# Altium schematic sheet Microprocessor PIC18F46K80.SCHDOC
size A4; PageSetup: Record=PageOptions|CenterHorizontal=True|CenterVertical=True|PrintScale=0.70|XCorrection=1.00|YCorrection=1.00|PrintKind=2|BorderSize=5000000|LeftOffset=0|BottomOffset=0|Orientation=2|PaperLength=1000|PaperWidth=1000|Scale=100|PaperSource=7|PrintQuality=-4|MediaType=1|DitherType=10|PaperKind=A4|PrintScaleMode=1; DocumentName: CCPA V203 (RELEASE)
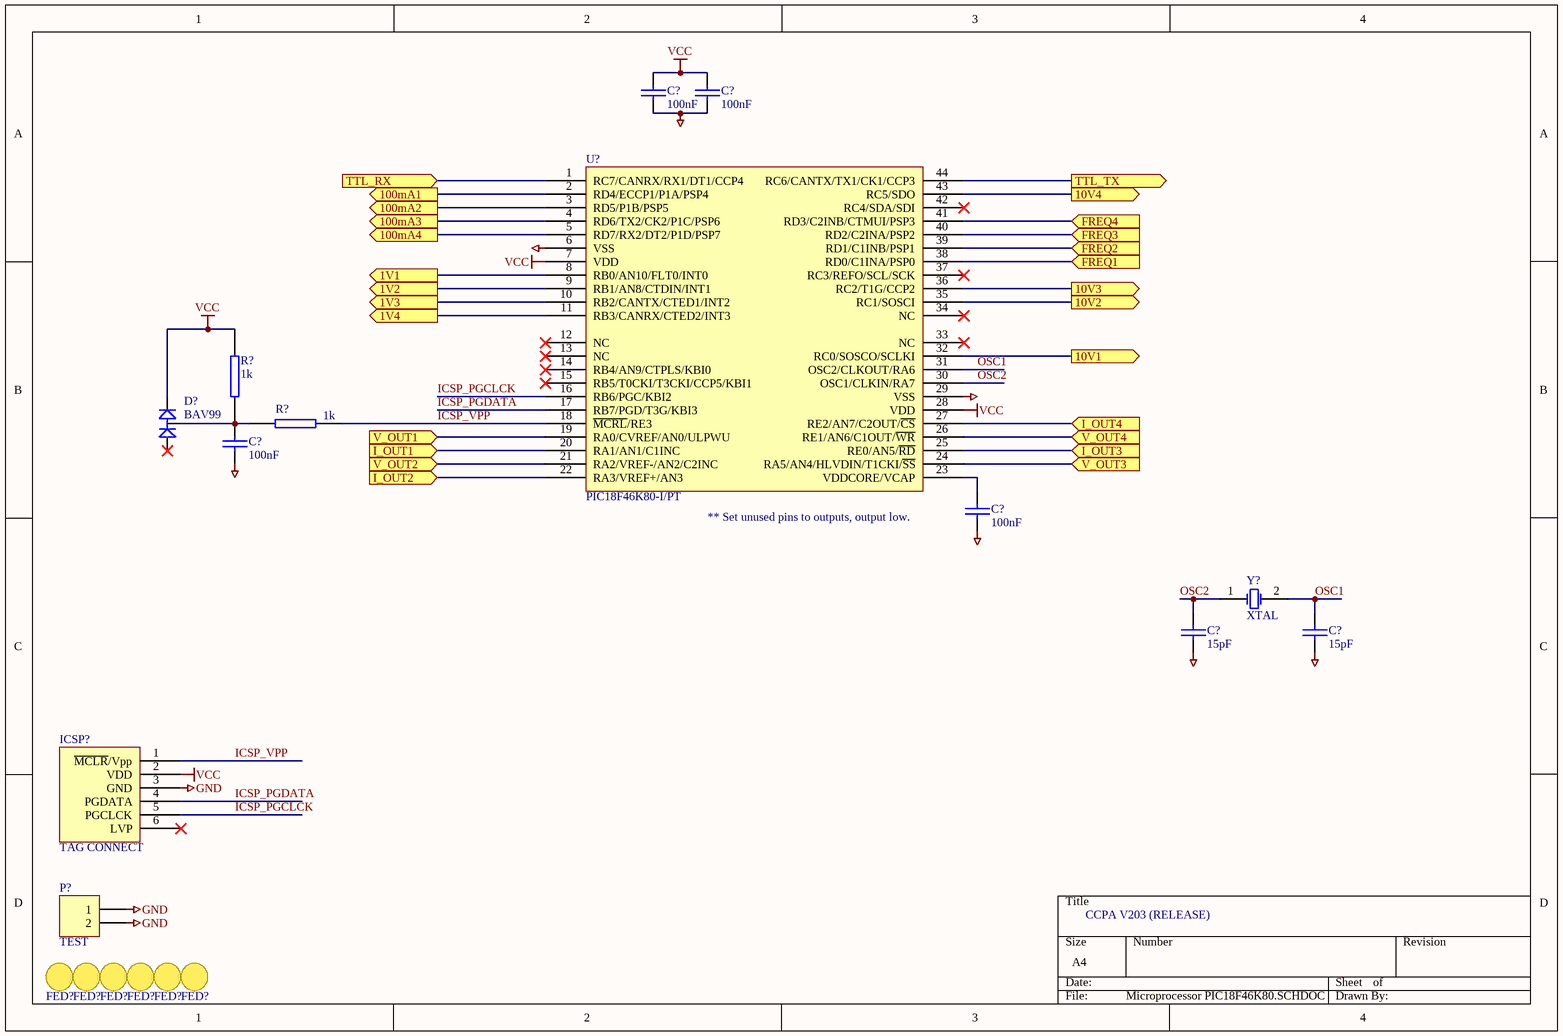
[diagram p0: Microprocessor PIC18F46K80.SCHDOC]

## Parts
(Parts that share a designator on the sheet are numbered #1, #2 ... from top to bottom, then left to right.)
C?#1  100nF  [CAP (3D) - 0603]
C?#2  100nF  [CAP (3D) - 0603]
C?#3  100nF  [CAP (3D) - 0603]
C?#4  100nF  [CAP (3D) - 0603]
C?#5  15pF  [CAP (3D) - 0603]
C?#6  15pF  [CAP (3D) - 0603]
D?  BAV99  [SOT23-3L]
FED?#1  Feducial  [Feducial]  (value not drawn)
FED?#2  Feducial  [Feducial]  (value not drawn)
FED?#3  Feducial  [Feducial]  (value not drawn)
FED?#4  Feducial  [Feducial]  (value not drawn)
FED?#5  Feducial  [Feducial]  (value not drawn)
FED?#6  Feducial  [Feducial]  (value not drawn)
ICSP?  TAG CONNECT  [ICSP - TAG CONNECT TYPE2]
P?  TEST  [HDR1X2]
R?#1  1k  [RES (3D) - 0603]
R?#2  1k  [RES (3D) - 0603]
U?  PIC18F46K80-I/PT  [TQFP44_L]
Y?  XTAL  [HC49/4H_SMX]

## Ports
1V1 (out), 1V2 (out), 1V3 (out), 1V4 (out), 10V1 (out), 10V2 (out), 10V3 (out), 10V4 (out), 100mA1 (out), 100mA2 (out), 100mA3 (out), 100mA4 (out), FREQ1 (in), FREQ2 (in), FREQ3 (in), FREQ4 (in), I_OUT1 (in), I_OUT2 (in), I_OUT3 (in), I_OUT4 (in), TTL_RX (in), TTL_TX (out), V_OUT1 (in), V_OUT2 (in), V_OUT3 (in), V_OUT4 (in)

## Nets
GND: C?#1.2 C?#2.2 C?#3.2 C?#4.2 C?#5.2 C?#6.2 ICSP?.3(GND) P?.1 P?.2 U?.6(VSS) U?.29(VSS)
VCC: C?#1.1 C?#2.1 D?.2(C2) ICSP?.2(VDD) R?#1.1 U?.7(VDD) U?.28(VDD)
1V1: U?.8(RB0/AN10/FLT0/INT0) ; port 1V1
1V2: U?.9(RB1/AN8/CTDIN/INT1) ; port 1V2
1V3: U?.10(RB2/CANTX/CTED1/INT2) ; port 1V3
1V4: U?.11(RB3/CANRX/CTED2/INT3) ; port 1V4
10V1: U?.32(RC0/SOSCO/SCLKI) ; port 10V1
10V2: U?.35(RC1/SOSCI) ; port 10V2
10V3: U?.36(RC2/T1G/CCP2) ; port 10V3
10V4: U?.43(RC5/SDO) ; port 10V4
100mA1: U?.2(RD4/ECCP1/P1A/PSP4) ; port 100mA1
100mA2: U?.3(RD5/P1B/PSP5) ; port 100mA2
100mA3: U?.4(RD6/TX2/CK2/P1C/PSP6) ; port 100mA3
100mA4: U?.5(RD7/RX2/DT2/P1D/PSP7) ; port 100mA4
FREQ1: U?.38(RD0/C1INA/PSP0) ; port FREQ1
FREQ2: U?.39(RD1/C1INB/PSP1) ; port FREQ2
FREQ3: U?.40(RD2/C2INA/PSP2) ; port FREQ3
FREQ4: U?.41(RD3/C2INB/CTMUI/PSP3) ; port FREQ4
I_OUT1: U?.20(RA1/AN1/C1INC) ; port I_OUT1
I_OUT2: U?.22(RA3/VREF+/AN3) ; port I_OUT2
I_OUT3: U?.25(RE0/AN5/~{RD}) ; port I_OUT3
I_OUT4: U?.27(RE2/AN7/C2OUT/~{CS}) ; port I_OUT4
ICSP_PGCLCK: ICSP?.5(PGCLCK) U?.16(RB6/PGC/KBI2)
ICSP_PGDATA: ICSP?.4(PGDATA) U?.17(RB7/PGD/T3G/KBI3)
ICSP_VPP: ICSP?.1(~{MCLR}/Vpp) R?#2.2 U?.18(~{MCRL}/RE3)
OSC1: C?#6.1 U?.31(OSC2/CLKOUT/RA6) Y?.2(OSC2)
OSC2: C?#5.1 U?.30(OSC1/CLKIN/RA7) Y?.1(OSC1)
TTL_RX: U?.1(RC7/CANRX/RX1/DT1/CCP4) ; port TTL_RX
TTL_TX: U?.44(RC6/CANTX/TX1/CK1/CCP3) ; port TTL_TX
V_OUT1: U?.19(RA0/CVREF/AN0/ULPWU) ; port V_OUT1
V_OUT2: U?.21(RA2/VREF-/AN2/C2INC) ; port V_OUT2
V_OUT3: U?.24(RA5/AN4/HLVDIN/T1CKI/~{SS}) ; port V_OUT3
V_OUT4: U?.26(RE1/AN6/C1OUT/~{WR}) ; port V_OUT4
NetC?#3_1: C?#3.1 D?.3(C1/A2) R?#1.2 R?#2.1
NetC?#4_1: C?#4.1 U?.23(VDDCORE/VCAP)

Not connected (* = marked no-connect by the designer): D? 1(A1)*; ICSP? 6(LVP)*; U? 12(NC)* 13(NC)* 14(RB4/AN9/CTPLS/KBI0)* 15(RB5/T0CKI/T3CKI/CCP5/KBI1)* 33(NC)* 34(NC)* 37(RC3/REFO/SCL/SCK)* 42(RC4/SDA/SDI)*

## Notes on the sheet
- (near C?#4) ** Set unused pins to outputs, output low.

## Library data of the parts
C?#1-C?#4 = CAP: CAPACITOR SMD 0402; Manufacturer: Murata; Manufacturer Part No.: GRM155R61C104KA88D; value: 100nF; Mouser Part no.: 81-GRM155R61C104KA8D; Web link: http://au.mouser.com/ProductDetail/Murata/GRM155R61C104KA88D/?qs=sGAEpiMZZMvQvaS66kI3TkNFPW5pBWErgqKrdkfeYZ0%3d; Farnell Part no.: 1414610
C?#5 C?#6 = CAP: CAPACITOR SMD 0402; Manufacturer: Xicon; Manufacturer Part No.: 140-CC504N150J-RC; value: 15pF; Mouser Part no.: 140-CC504N150J-RC; Web link: http://au.mouser.com/ProductDetail/Xicon/140-CC504N150J-RC/?qs=0ZUpllj3bsY%252bl3b%252btrhy8ZRrWnFRAos3
D? = BAV99: DUAL DIODE, BAV99; Manufacturer: FAIRCHILD SEMICONDUCTOR; Mouser Part no.: 771-BAV99/T3; Manufacturer Part No.: BAV99; value: BAV99; Web link: http://au.mouser.com/ProductDetail/NXP/BAV99-T3/?qs=84A%2fDAdkstK527JD1pwcnQ%3d%3d
FED?#1-FED?#6 = Feducial: Manufacturer: N/A - PCB ARTWORK; Manufacturer Part No.: N/A
ICSP? = ICSP - TAG CONNECT: Manufacturer: N/A - PCB ARTWORK; Manufacturer Part No.: N/A; Mouser Part no.: N/A; Web link: N/A - PCB ARTWORK
P? = Header 2: Header, 2-Pin; Manufacturer: Bourns; Manufacturer Part No.: CR0603-FX-5900ELF; value: 590R; Mouser Part no.: 652-CR0603FX-5900ELF; Web link: http://au.mouser.com/Search/Refine.aspx?Keyword=652-CR0603FX-5900ELF
R?#1 = RES SMD 0603 10k: RESISTOR SMD 0603 10k; Manufacturer: Bourns; Manufacturer Part No.: CR0603-JW-102ELF; Mouser Part no.: 652-CR0603-JW-102ELF; Web link: http://au.mouser.com/ProductDetail/Bourns/CR0603-JW-102ELF/?qs=sGAEpiMZZMu61qfTUdNhG2nPoCjtvs%252bRXTOJv8O9Kbk%3d; value: 1k; Farnell Part no.: 9331700
R?#2 = RES SMD 0603 100R: RESISTOR SMD 0603; Manufacturer: Bourns; Manufacturer Part No.: CR0603-JW-102ELF; Mouser Part no.: 652-CR0603-JW-102ELF; Farnell Part no.: 9331700; Web link: http://au.mouser.com/ProductDetail/Bourns/CR0603-JW-102ELF/?qs=sGAEpiMZZMu61qfTUdNhG2nPoCjtvs%252bRXTOJv8O9Kbk%3d; Value: 1k
U? = PIC18F4XK80-I/PT: Manufacturer: MICROCHIP; Manufacturer Part No.: PIC18F46K80-I/PT; Mouser Part no.: 579-PIC18F46K80-I/PT; value: PIC18F46K80-I/PT; Web link: http://au.mouser.com/ProductDetail/Microchip/PIC18F46K80-I-PT/?qs=LU7oW20kJpOTrBvFk2hM5g%3d%3d
Y? = XTAL: Crystal Oscillator; Manufacturer: ECS; Manufacturer Part No.: ECS-160-20-5PX-TR; value: 16MHz; Mouser Part no.: 520-CSM1600-20-X; Web link: http://au.mouser.com/ProductDetail/ECS/ECS-160-20-5PX-TR/?qs=CkbNAJEAr%2fRSmE52Hssuc4XnCMYWVt7B